# Altium schematic sheet OpenPLCv0.2.0_ComputeModule.SchDoc
size 420 x 297 mm; PageSetup: Record=PageOptions|CenterHorizontal=True|CenterVertical=True|PrintScale=1.01|XCorrection=1.00|YCorrection=1.00|PrintKind=1|BorderSize=5000000|LeftOffset=0|BottomOffset=0|Orientation=2|PaperLength=1000|PaperWidth=1000|Scale=100|PaperSource=7|PrintQuality=-4|MediaType=1|DitherType=10|PaperKind=A3|PrintScaleMode=1; DocumentNumber: 2; SheetNumber: 2; SheetTotal: 22; SheetTitle: Compute Module 4
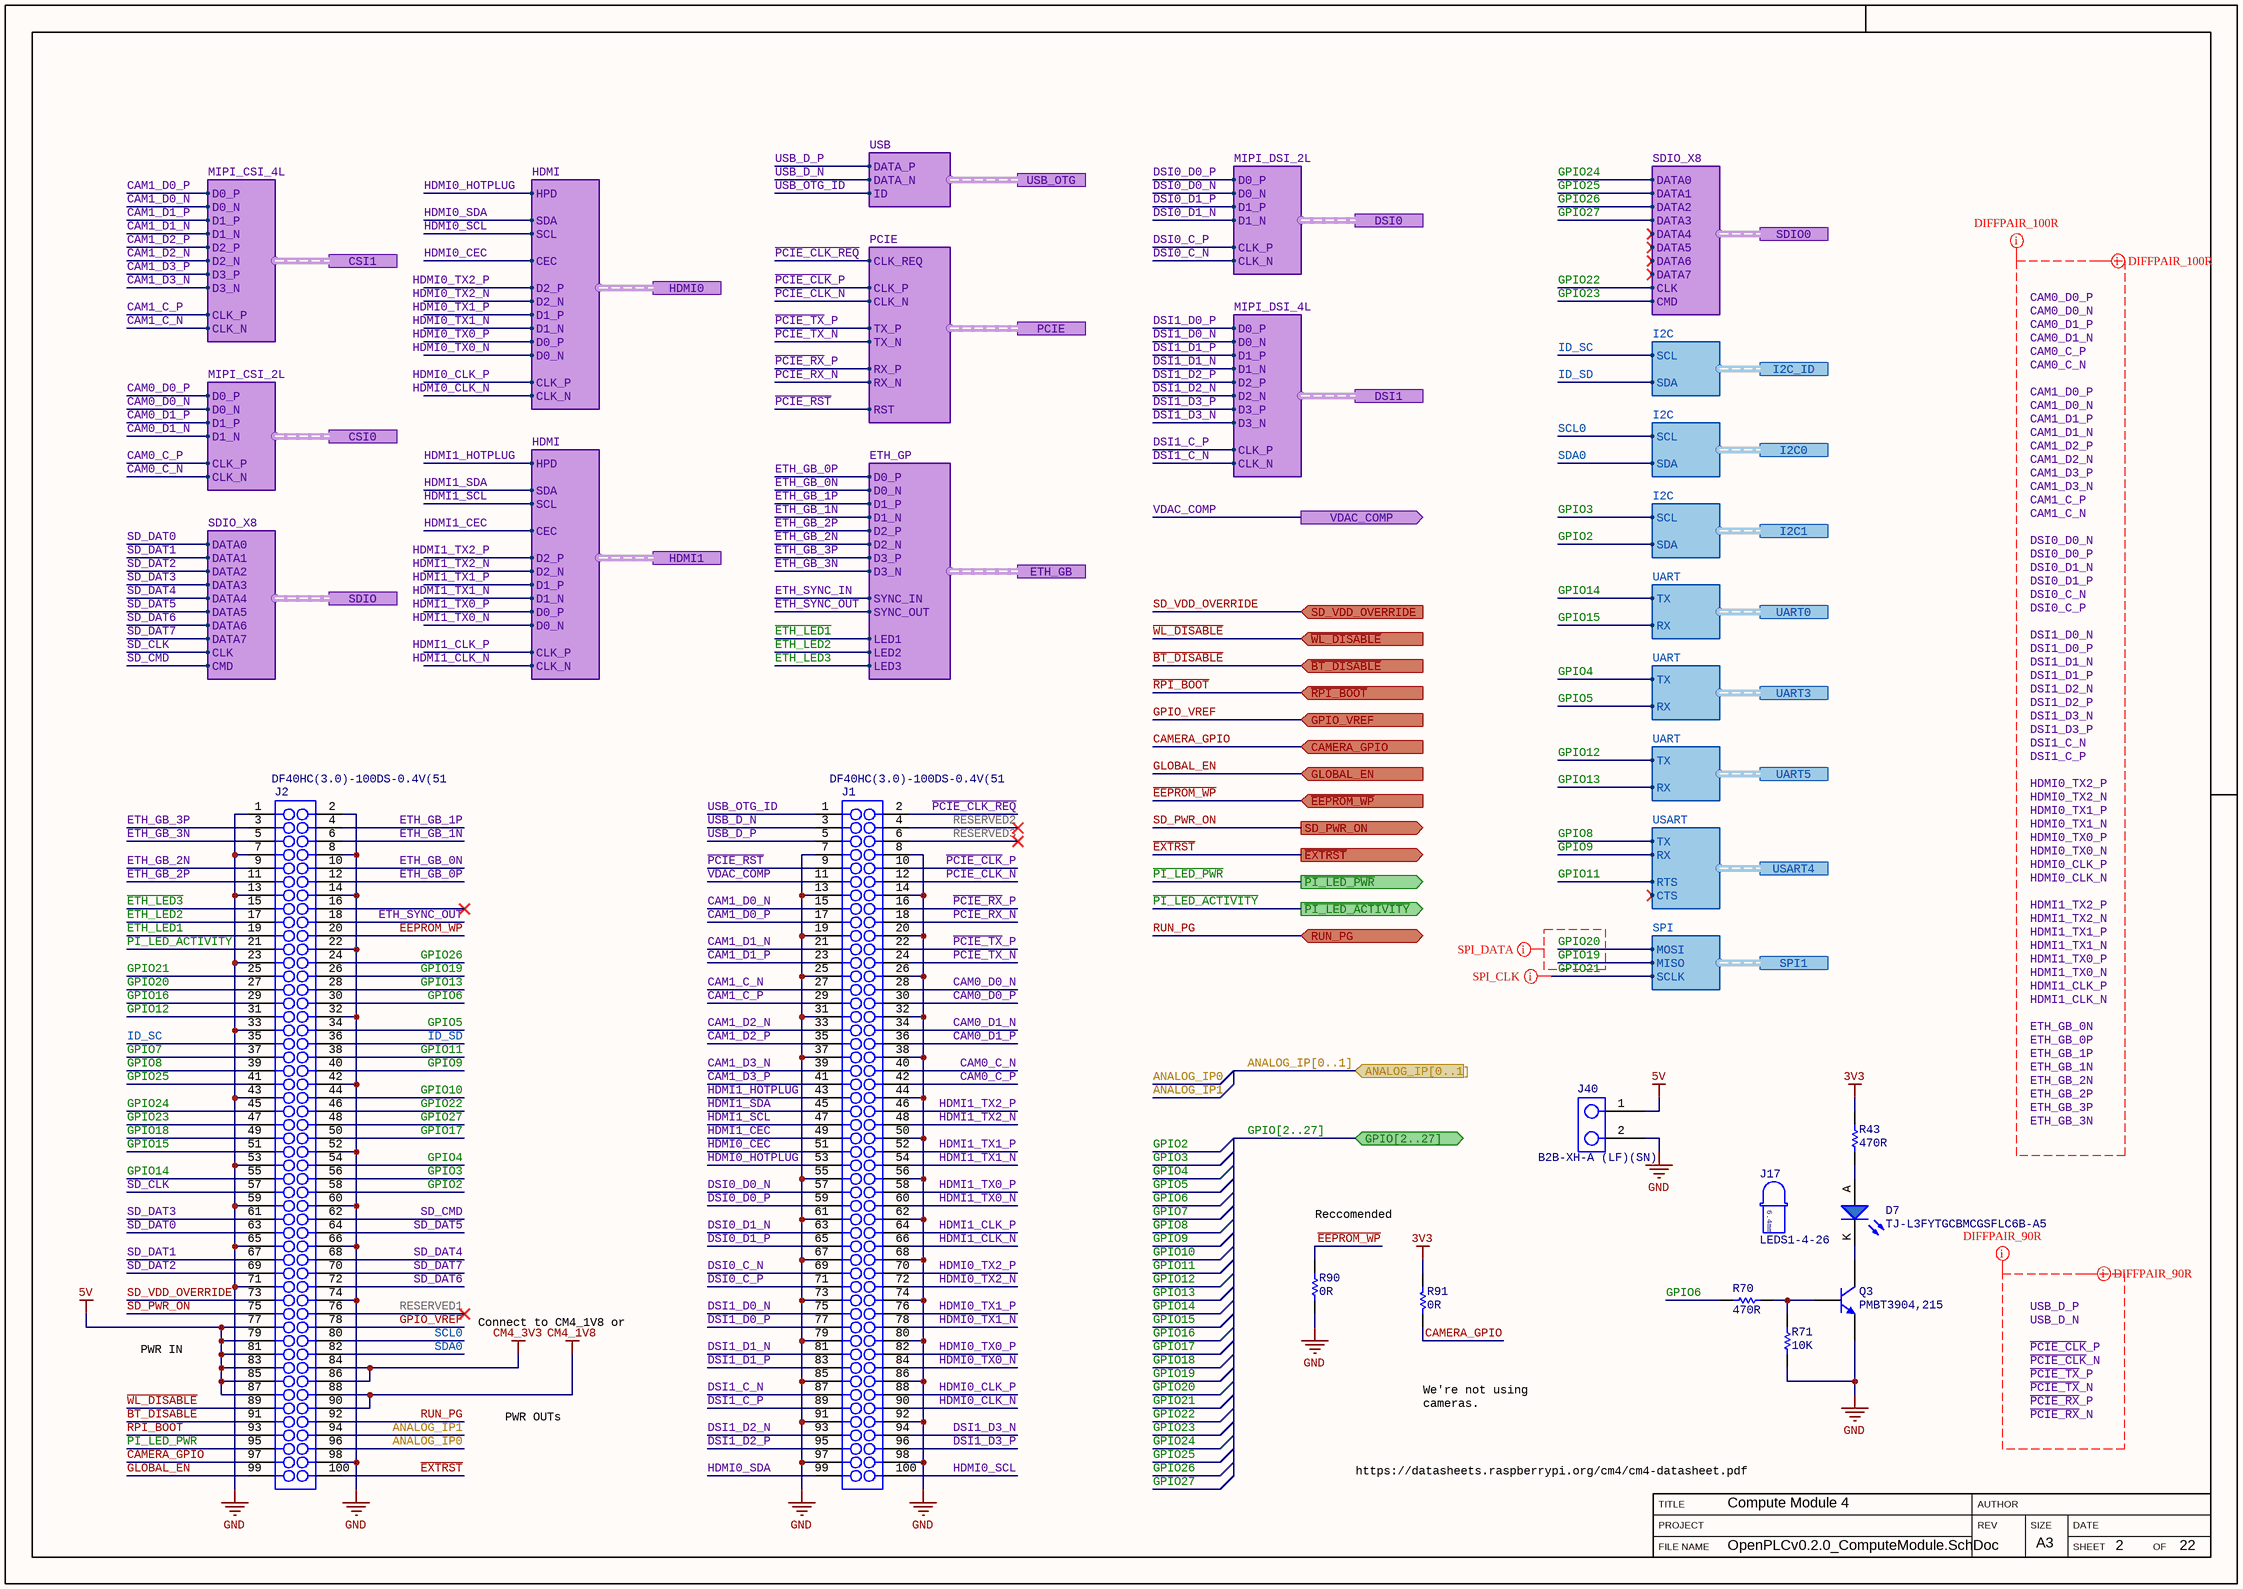
[diagram p0: OpenPLCv0.2.0_ComputeModule.SchDoc]

## Parts
D7  TJ-L3FYTGCBMCGSFLC6B-A5  [LED_3MM_SPACED_6.4MM_BLUE]
J1  DF40HC(3.0)-100DS-0.4V(51  [DF40HC(3.0)-100DS-0.4V(51]
J2  DF40HC(3.0)-100DS-0.4V(51  [DF40HC(3.0)-100DS-0.4V(51]
J17  LEDS1-4-26  [3MM_LED_SPACER_6.4MM]
J40  B2B-XH-A (LF)(SN)  [B2B-XH-A (LF)(SN)]
Q3  PMBT3904,215  [SOT23-3]
R43  Resistance: 470R  [SMD_RES_0402(1005)_N]  (hidden comment: RC0402FR-07470RL)
R70  Resistance: 470R  [SMD_RES_0402(1005)_N]  (hidden comment: RC0402FR-07470RL)
R71  Resistance: 10K  [SMD_RES_0402(1005)_N]  (hidden comment: RC0402FR-0710KL)
R90  Resistance: 0R  [SMD_RES_0402(1005)_N]  (hidden comment: RC0402FR-070RL)
R91  Resistance: 0R  [SMD_RES_0402(1005)_N]  (hidden comment: RC0402FR-070RL)

## Ports
ANALOG_IP[0..1] (in), CAMERA_GPIO (in), CSI0 (harness MIPI_CSI_2L), CSI1 (harness MIPI_CSI_4L), DSI0 (harness MIPI_DSI_2L), DSI1 (harness MIPI_DSI_4L), ETH_GB (harness ETH_GP), GLOBAL_EN (in), GPIO[2..27] (bidir), GPIO_VREF (in), HDMI0 (harness HDMI), HDMI1 (harness HDMI), I2C0 (harness I2C), I2C1 (harness I2C), I2C_ID (harness I2C), PCIE (harness PCIE), RUN_PG (bidir), SD_PWR_ON (out), SD_VDD_OVERRIDE (in), SDIO0 (harness SDIO_X8), SDIO (harness SDIO_X8), SPI1 (harness SPI), UART0 (harness UART), UART3 (harness UART), UART5 (harness UART), USART4 (harness USART), USB_OTG (harness USB), VDAC_COMP (out), ~{BT_DISABLE} (in), ~{EEPROM_WP} (in), ~{EXTRST} (out), ~{PI_LED_ACTIVITY} (out), ~{PI_LED_PWR} (out), ~{RPI_BOOT} (in), ~{WL_DISABLE} (in)

## Harnesses
USB: DATA_P, DATA_N, ID
MIPI_CSI_4L: D1_N, D1_P, D0_P, D0_N, CLK_P, CLK_N, D2_N, D2_P, D3_N, D3_P
MIPI_CSI_2L: D1_N, D1_P, D0_P, D0_N, CLK_P, CLK_N
SDIO_X8: DATA1, DATA0, DATA2, DATA3, DATA4, DATA5, DATA6, CMD, CLK, DATA7
HDMI: CLK_P, CLK_N, D0_P, D0_N, D2_N, D2_P, D1_N, D1_P, CEC, HPD, SDA, SCL
PCIE: CLK_P, CLK_N, TX_P, TX_N, RX_P, RX_N, CLK_REQ, RST
ETH_GP: D0_P, D0_N, D1_P, D1_N, D2_P, D2_N, D3_P, D3_N, SYNC_IN, SYNC_OUT, LED1, LED2, LED3
MIPI_DSI_4L: D1_N, D1_P, D0_P, D0_N, CLK_P, CLK_N, D2_N, D2_P, D3_N, D3_P
MIPI_DSI_2L: D1_N, D1_P, D0_P, D0_N, CLK_P, CLK_N
I2C: SCL, SDA
UART: TX, RX
SPI: MOSI, MISO, SCLK
USART: TX, RX, RTS, CTS

## Nets
3V3: R43.1 R91.1
5V: J2.77 J2.79 J2.81 J2.83 J2.85 J2.87 J40.1
CM4_1V8: J2.88 J2.90
CM4_3V3: J2.84 J2.86
GND: J1.7 J1.8 J1.13 J1.14 J1.19 J1.20 J1.25 J1.26 J1.31 J1.32 J1.37 J1.38 J1.44 J1.50 J1.55 J1.56 J1.61 J1.62 J1.67 J1.68 J1.73 J1.74 J1.79 J1.80 J1.85 J1.86 J1.91 J1.92 J1.97 J1.98 J2.1 J2.2 J2.7 J2.8 J2.13 J2.14 J2.22 J2.23 J2.32 J2.33 J2.42 J2.43 J2.52 J2.53 J2.59 J2.60 J2.65 J2.66 J2.71 J2.74 J2.98 J40.2 Q3.2(E) R71.1 R90.1
ANALOG_IP0: J2.96
ANALOG_IP1: J2.94
~{BT_DISABLE}: J2.91 ; port ~{BT_DISABLE}
CAM0_C_N: J1.40 ; port CSI0.CLK_N
CAM0_C_P: J1.42 ; port CSI0.CLK_P
CAM0_D0_N: J1.28 ; port CSI0.D0_N
CAM0_D0_P: J1.30 ; port CSI0.D0_P
CAM0_D1_N: J1.34 ; port CSI0.D1_N
CAM0_D1_P: J1.36 ; port CSI0.D1_P
CAM1_C_N: J1.27 ; port CSI1.CLK_N
CAM1_C_P: J1.29 ; port CSI1.CLK_P
CAM1_D0_N: J1.15 ; port CSI1.D0_N
CAM1_D0_P: J1.17 ; port CSI1.D0_P
CAM1_D1_N: J1.21 ; port CSI1.D1_N
CAM1_D1_P: J1.23 ; port CSI1.D1_P
CAM1_D2_N: J1.33 ; port CSI1.D2_N
CAM1_D2_P: J1.35 ; port CSI1.D2_P
CAM1_D3_N: J1.39 ; port CSI1.D3_N
CAM1_D3_P: J1.41 ; port CSI1.D3_P
CAMERA_GPIO: J2.97 R91.2 ; port CAMERA_GPIO
DSI0_C_N: J1.69 ; port DSI0.CLK_N
DSI0_C_P: J1.71 ; port DSI0.CLK_P
DSI0_D0_N: J1.57 ; port DSI0.D0_N
DSI0_D0_P: J1.59 ; port DSI0.D0_P
DSI0_D1_N: J1.63 ; port DSI0.D1_N
DSI0_D1_P: J1.65 ; port DSI0.D1_P
DSI1_C_N: J1.87 ; port DSI1.CLK_N
DSI1_C_P: J1.89 ; port DSI1.CLK_P
DSI1_D0_N: J1.75 ; port DSI1.D0_N
DSI1_D0_P: J1.77 ; port DSI1.D0_P
DSI1_D1_N: J1.81 ; port DSI1.D1_N
DSI1_D1_P: J1.83 ; port DSI1.D1_P
DSI1_D2_N: J1.93 ; port DSI1.D2_N
DSI1_D2_P: J1.95 ; port DSI1.D2_P
DSI1_D3_N: J1.94 ; port DSI1.D3_N
DSI1_D3_P: J1.96 ; port DSI1.D3_P
~{EEPROM_WP}: J2.20 R90.2 ; port ~{EEPROM_WP}
~{ETH_LED1}: J2.19 ; port ETH_GB.LED1
~{ETH_LED2}: J2.17 ; port ETH_GB.LED2
~{ETH_LED3}: J2.15 ; port ETH_GB.LED3
~{EXTRST}: J2.100 ; port ~{EXTRST}
ETH_GB_0N: J2.10 ; port ETH_GB.D0_N
ETH_GB_0P: J2.12 ; port ETH_GB.D0_P
ETH_GB_1N: J2.6 ; port ETH_GB.D1_N
ETH_GB_1P: J2.4 ; port ETH_GB.D1_P
ETH_GB_2N: J2.9 ; port ETH_GB.D2_N
ETH_GB_2P: J2.11 ; port ETH_GB.D2_P
ETH_GB_3N: J2.5 ; port ETH_GB.D3_N
ETH_GB_3P: J2.3 ; port ETH_GB.D3_P
ETH_SYNC_IN: port ETH_GB.SYNC_IN
ETH_SYNC_OUT: J2.18 ; port ETH_GB.SYNC_OUT
GLOBAL_EN: J2.99 ; port GLOBAL_EN
GPIO2: J2.58 ; port I2C1.SDA
GPIO3: J2.56 ; port I2C1.SCL
GPIO4: J2.54 ; port UART3.TX
GPIO5: J2.34 ; port UART3.RX
GPIO6: J2.30 R70.2
GPIO7: J2.37
GPIO8: J2.39 ; port USART4.TX
GPIO9: J2.40 ; port USART4.RX
GPIO10: J2.44
GPIO11: J2.38 ; port USART4.RTS
GPIO12: J2.31 ; port UART5.TX
GPIO13: J2.28 ; port UART5.RX
GPIO14: J2.55 ; port UART0.TX
GPIO15: J2.51 ; port UART0.RX
GPIO16: J2.29
GPIO17: J2.50
GPIO18: J2.49
GPIO19: J2.26 ; port SPI1.MISO
GPIO20: J2.27 ; port SPI1.MOSI
GPIO21: J2.25 ; port SPI1.SCLK
GPIO22: J2.46 ; port SDIO0.CLK
GPIO23: J2.47 ; port SDIO0.CMD
GPIO24: J2.45 ; port SDIO0.DATA0
GPIO25: J2.41 ; port SDIO0.DATA1
GPIO26: J2.24 ; port SDIO0.DATA2
GPIO27: J2.48 ; port SDIO0.DATA3
GPIO_VREF: J2.78 ; port GPIO_VREF
HDMI0_CEC: J1.51 ; port HDMI0.CEC
HDMI0_CLK_N: J1.90 ; port HDMI0.CLK_N
HDMI0_CLK_P: J1.88 ; port HDMI0.CLK_P
HDMI0_HOTPLUG: J1.53 ; port HDMI0.HPD
HDMI0_SCL: J1.100 ; port HDMI0.SCL
HDMI0_SDA: J1.99 ; port HDMI0.SDA
HDMI0_TX0_N: J1.84 ; port HDMI0.D0_N
HDMI0_TX0_P: J1.82 ; port HDMI0.D0_P
HDMI0_TX1_N: J1.78 ; port HDMI0.D1_N
HDMI0_TX1_P: J1.76 ; port HDMI0.D1_P
HDMI0_TX2_N: J1.72 ; port HDMI0.D2_N
HDMI0_TX2_P: J1.70 ; port HDMI0.D2_P
HDMI1_CEC: J1.49 ; port HDMI1.CEC
HDMI1_CLK_N: J1.66 ; port HDMI1.CLK_N
HDMI1_CLK_P: J1.64 ; port HDMI1.CLK_P
HDMI1_HOTPLUG: J1.43 ; port HDMI1.HPD
HDMI1_SCL: J1.47 ; port HDMI1.SCL
HDMI1_SDA: J1.45 ; port HDMI1.SDA
HDMI1_TX0_N: J1.60 ; port HDMI1.D0_N
HDMI1_TX0_P: J1.58 ; port HDMI1.D0_P
HDMI1_TX1_N: J1.54 ; port HDMI1.D1_N
HDMI1_TX1_P: J1.52 ; port HDMI1.D1_P
HDMI1_TX2_N: J1.48 ; port HDMI1.D2_N
HDMI1_TX2_P: J1.46 ; port HDMI1.D2_P
ID_SC: J2.35 ; port I2C_ID.SCL
ID_SD: J2.36 ; port I2C_ID.SDA
~{PCIE_CLK_REQ}: J1.2 ; port PCIE.CLK_REQ
~{PCIE_CLK}_N: J1.12 ; port PCIE.CLK_N
~{PCIE_CLK}_P: J1.10 ; port PCIE.CLK_P
~{PCIE_RST}: J1.9 ; port PCIE.RST
~{PCIE_RX}_N: J1.18 ; port PCIE.RX_N
~{PCIE_RX}_P: J1.16 ; port PCIE.RX_P
~{PCIE_TX}_N: J1.24 ; port PCIE.TX_N
~{PCIE_TX}_P: J1.22 ; port PCIE.TX_P
~{PI_LED_ACTIVITY}: J2.21 ; port ~{PI_LED_ACTIVITY}
~{PI_LED_PWR}: J2.95 ; port ~{PI_LED_PWR}
~{RPI_BOOT}: J2.93 ; port ~{RPI_BOOT}
RESERVED1: J2.76
RESERVED2: J1.4
RESERVED3: J1.6
RUN_PG: J2.92 ; port RUN_PG
SCL0: J2.80 ; port I2C0.SCL
SD_CLK: J2.57 ; port SDIO.CLK
SD_CMD: J2.62 ; port SDIO.CMD
SD_DAT0: J2.63 ; port SDIO.DATA0
SD_DAT1: J2.67 ; port SDIO.DATA1
SD_DAT2: J2.69 ; port SDIO.DATA2
SD_DAT3: J2.61 ; port SDIO.DATA3
SD_DAT4: J2.68 ; port SDIO.DATA4
SD_DAT5: J2.64 ; port SDIO.DATA5
SD_DAT6: J2.72 ; port SDIO.DATA6
SD_DAT7: J2.70 ; port SDIO.DATA7
SD_PWR_ON: J2.75 ; port SD_PWR_ON
SD_VDD_OVERRIDE: J2.73 ; port SD_VDD_OVERRIDE
SDA0: J2.82 ; port I2C0.SDA
USB_D_N: J1.3 ; port USB_OTG.DATA_N
USB_D_P: J1.5 ; port USB_OTG.DATA_P
USB_OTG_ID: J1.1 ; port USB_OTG.ID
VDAC_COMP: J1.11 ; port VDAC_COMP
~{WL_DISABLE}: J2.89 ; port ~{WL_DISABLE}
NetD7_A: D7.A R43.2
NetD7_K: D7.K Q3.3(C)
NetQ3_1: Q3.1(B) R70.1 R71.2

Not connected (* = marked no-connect by the designer): J2 16*

## Buses and harness runs
bus ANALOG_IP[0..1] = port ANALOG_IP[0..1]
bus GPIO[2..27] = port GPIO[2..27]

## Layout directives
differential pair; differential pair class 90R_DIFF_PAIRS; net class 90R_PAIRS: USB_D_N, USB_D_P, ~{PCIE_CLK}_N, ~{PCIE_CLK}_P, ~{PCIE_RX}_N, ~{PCIE_RX}_P, ~{PCIE_TX}_N, ~{PCIE_TX}_P
differential pair; differential pair class 100R_DIFF_PAIRS; net class 100R_PAIRS: CAM0_C_N, CAM0_C_P, CAM0_D0_N, CAM0_D0_P, CAM0_D1_N, CAM0_D1_P, CAM1_C_N, CAM1_C_P, CAM1_D0_N, CAM1_D0_P, CAM1_D1_N, CAM1_D1_P, CAM1_D2_N, CAM1_D2_P, CAM1_D3_N, CAM1_D3_P, DSI0_C_N, DSI0_C_P, DSI0_D0_N, DSI0_D0_P, DSI0_D1_N, DSI0_D1_P, DSI1_C_N, DSI1_C_P, DSI1_D0_N, DSI1_D0_P, DSI1_D1_N, DSI1_D1_P, DSI1_D2_N, DSI1_D2_P, DSI1_D3_N, DSI1_D3_P, ETH_GB_0N, ETH_GB_0P, ETH_GB_1N, ETH_GB_1P, ETH_GB_2N, ETH_GB_2P, ETH_GB_3N, ETH_GB_3P, HDMI0_CLK_N, HDMI0_CLK_P, HDMI0_TX0_N, HDMI0_TX0_P, HDMI0_TX1_N, HDMI0_TX1_P, HDMI0_TX2_N, HDMI0_TX2_P, HDMI1_CLK_N, HDMI1_CLK_P, HDMI1_TX0_N, HDMI1_TX0_P, HDMI1_TX1_N, HDMI1_TX1_P, HDMI1_TX2_N, HDMI1_TX2_P
mark named DIFFPAIR_100R: CAM0_C_N, CAM0_C_P, CAM0_D0_N, CAM0_D0_P, CAM0_D1_N, CAM0_D1_P, CAM1_C_N, CAM1_C_P, CAM1_D0_N, CAM1_D0_P, CAM1_D1_N, CAM1_D1_P, CAM1_D2_N, CAM1_D2_P, CAM1_D3_N, CAM1_D3_P, DSI0_C_N, DSI0_C_P, DSI0_D0_N, DSI0_D0_P, DSI0_D1_N, DSI0_D1_P, DSI1_C_N, DSI1_C_P, DSI1_D0_N, DSI1_D0_P, DSI1_D1_N, DSI1_D1_P, DSI1_D2_N, DSI1_D2_P, DSI1_D3_N, DSI1_D3_P, ETH_GB_0N, ETH_GB_0P, ETH_GB_1N, ETH_GB_1P, ETH_GB_2N, ETH_GB_2P, ETH_GB_3N, ETH_GB_3P, HDMI0_CLK_N, HDMI0_CLK_P, HDMI0_TX0_N, HDMI0_TX0_P, HDMI0_TX1_N, HDMI0_TX1_P, HDMI0_TX2_N, HDMI0_TX2_P, HDMI1_CLK_N, HDMI1_CLK_P, HDMI1_TX0_N, HDMI1_TX0_P, HDMI1_TX1_N, HDMI1_TX1_P, HDMI1_TX2_N, HDMI1_TX2_P
mark named DIFFPAIR_90R: USB_D_N, USB_D_P, ~{PCIE_CLK}_N, ~{PCIE_CLK}_P, ~{PCIE_RX}_N, ~{PCIE_RX}_P, ~{PCIE_TX}_N, ~{PCIE_TX}_P
net class SPI_CLK: GPIO21
net class SPI_DATA: GPIO19, GPIO20

## Notes on the sheet
- Reccomended
- Connect to CM4_1V8 or CM4_3V3
- PWR IN
- We're not using cameras.
- PWR OUTs
- https://datasheets.raspberrypi.org/cm4/cm4-datasheet.pdf
- Labels drawn without touching a wire or pin: CAM0_C_N, CAM0_C_P, CAM0_D0_N, CAM0_D0_P, CAM0_D1_N, CAM0_D1_P, CAM1_C_N, CAM1_C_P, CAM1_D0_N, CAM1_D0_P, CAM1_D1_N, CAM1_D1_P, CAM1_D2_N, CAM1_D2_P, CAM1_D3_N, CAM1_D3_P, DSI0_C_N, DSI0_C_P, DSI0_D0_N, DSI0_D0_P, DSI0_D1_N, DSI0_D1_P, DSI1_C_N, DSI1_C_P, DSI1_D0_N, DSI1_D0_P, DSI1_D1_N, DSI1_D1_P, DSI1_D2_N, DSI1_D2_P, DSI1_D3_N, DSI1_D3_P, ETH_GB_0N, ETH_GB_0P, ETH_GB_1N, ETH_GB_1P, ETH_GB_2N, ETH_GB_2P, ETH_GB_3N, ETH_GB_3P, HDMI0_CLK_N, HDMI0_CLK_P, HDMI0_TX0_N, HDMI0_TX0_P, HDMI0_TX1_N, HDMI0_TX1_P, HDMI0_TX2_N, HDMI0_TX2_P, HDMI1_CLK_N, HDMI1_CLK_P, HDMI1_TX0_N, HDMI1_TX0_P, HDMI1_TX1_N, HDMI1_TX1_P, HDMI1_TX2_N, HDMI1_TX2_P, USB_D_N, USB_D_P, ~{PCIE_CLK}_N, ~{PCIE_CLK}_P, ~{PCIE_RX}_N, ~{PCIE_RX}_P, ~{PCIE_TX}_N, ~{PCIE_TX}_P
- FILE NAME
- PROJECT
- TITLE
- REV
- AUTHOR
- SIZE
- SHEET
- DATE
- OF
- A3
- (in symbol LEDS1-4-26) 6.4mm

## Library data of the parts
D7 = TJ-L3FYTGCBMCGSFLC6B-A5: LED 3mm Blue 460nm~470nm 2.7V~3.6V Through Hole Light Emitting Diodes (LED) RoHS C330760
J1 J2 = DF40HC(3.0)-100DS-0.4V(51: Conn Board to Board RCP 100 POS 0.4mm Solder ST SMD T/R
J17 = LEDS1-4-26: 3mm LED spacer 6.4mm height
J40 = B2B-XH-A (LF)(SN): Pin Header, Vertical, Wire-to-Board, 2.5 mm, 1 Rows, 2 Contacts, Through Hole Straight, XH Series
Q3 = PMBT3904,215: NPN 200mA 40V 250mW SOT-23(SOT-23-3) Transistors (NPN/PNP) RoHS
R43 R70 = 470R 0402 1% 1W: 470Ω ±1% 1/16W ±100ppm/℃ 0402 Chip Resistor - Surface Mount RoHS; Power Rating: 1W; Package: 0402; Tolerance: 1%
R71 = 10K 0402 1% 1/16W: 10kΩ ±1% 1/16W ±100ppm/℃ 0402 Chip Resistor - Surface Mount RoHS; Package: 0402; Tolerance: 1%; Power Rating: 1/16W
R90 R91 = 0R 0402 1% 1/16W: 0Ω ±1% 1/16W 0402 Chip Resistor - Surface Mount RoHS; Package: 0402; Tolerance: 1%; Power Rating: 1/16W